# Altium schematic sheet XACT.SchDoc
size B
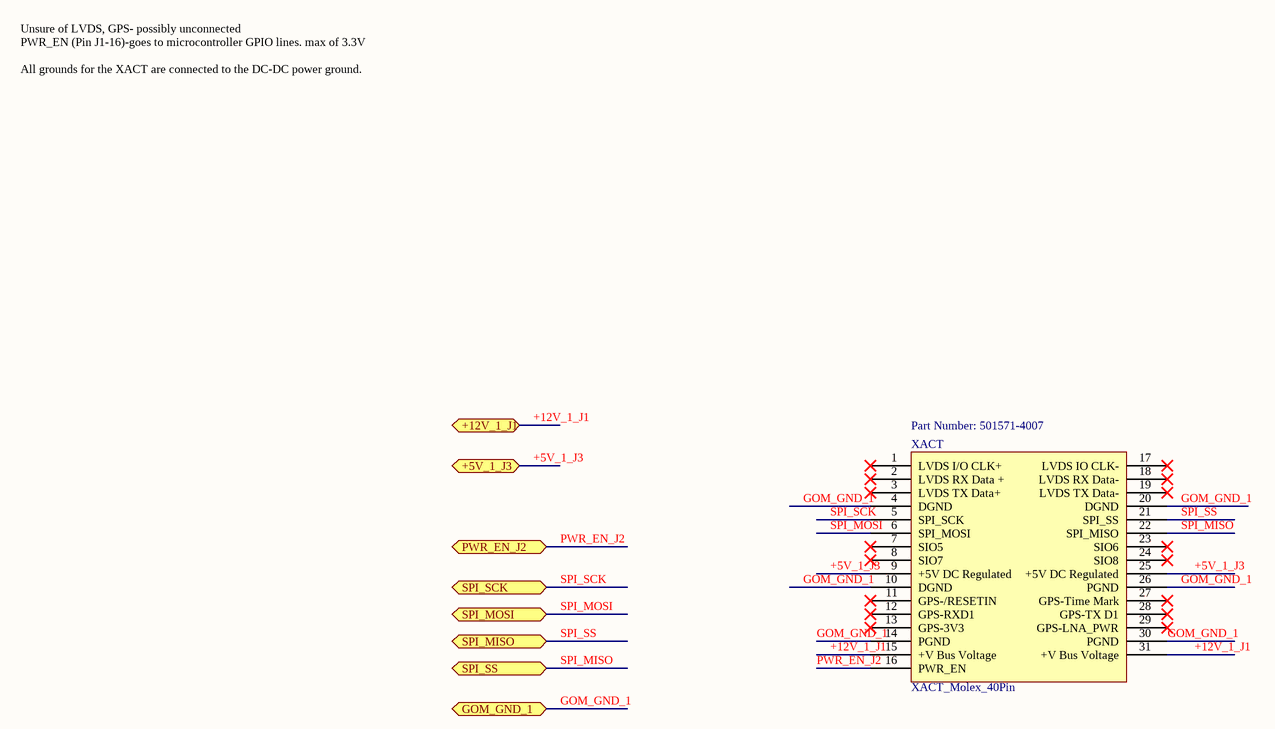
[diagram p0: XACT.SchDoc]

## Parts
XACT  XACT_Molex_40Pin  [XACT_Molex_40Pin]

## Ports
+5V_1_J3 (bidir), +12V_1_J1 (bidir), GOM_GND_1 (bidir), PWR_EN_J2 (bidir), SPI_MISO (bidir), SPI_MOSI (bidir), SPI_SCK (bidir), SPI_SS (bidir)

## Nets
+5V_1_J3: XACT.9(+5V_DC_Regulated) XACT.25(+5V_DC_Regulated) ; port +5V_1_J3
+12V_1_J1: XACT.15(+V_Bus_Voltage) XACT.31(+V_Bus_Voltage) ; port +12V_1_J1
GOM_GND_1: XACT.4(DGND) XACT.10(DGND) XACT.14(PGND) XACT.20(DGND) XACT.26(PGND) XACT.30(PGND) ; port GOM_GND_1
PWR_EN_J2: XACT.16(PWR_EN) ; port PWR_EN_J2
SPI_MISO: XACT.22(SPI_MISO) ; port SPI_SS
SPI_MOSI: XACT.6(SPI_MOSI) ; port SPI_MOSI
SPI_SCK: XACT.5(SPI_SCK) ; port SPI_SCK
SPI_SS: XACT.21(SPI_SS) ; port SPI_MISO

Not connected (* = marked no-connect by the designer): XACT 1(LVDS_I/O_CLK+)* 2(LVDS_RX_Data_+)* 3(LVDS_TX_Data+)* 7(SIO5)* 8(SIO7)* 11(GPS-/RESETIN)* 12(GPS-RXD1)* 13(GPS-3V3)* 17(LVDS_IO_CLK-)* 18(LVDS_RX_Data-)* 19(LVDS_TX_Data-)* 23(SIO6)* 24(SIO8)* 27(GPS-Time_Mark)* 28(GPS-TX_D1)* 29(GPS-LNA_PWR)*

## Notes on the sheet
- Unsure of LVDS, GPS- possibly unconnected
  PWR_EN (Pin J1-16)-goes to microcontroller GPIO lines. max of 3.3V
  All grounds for the XACT are connected to the DC-DC power ground.
- (near XACT) Part Number: 501571-4007

## Library data of the parts
XACT = XACT_Molex_40Pin: 31 Pin Airborn Nano Connector; pin to pad: 1>A1 2>A2 3>A3 4>A4 5>A5 6>A6 7>A7 8>A8 9>A9 10>A10 11>A11 12>A12 13>A13 14>A14 15>A15 16>A16 17>A17 18>A18 19>A19 20>A20 21>A21 22>A22 23>A23 24>A24 25>A25 26>A26 27>A27 28>A28 29>A29 30>A30 31>A31